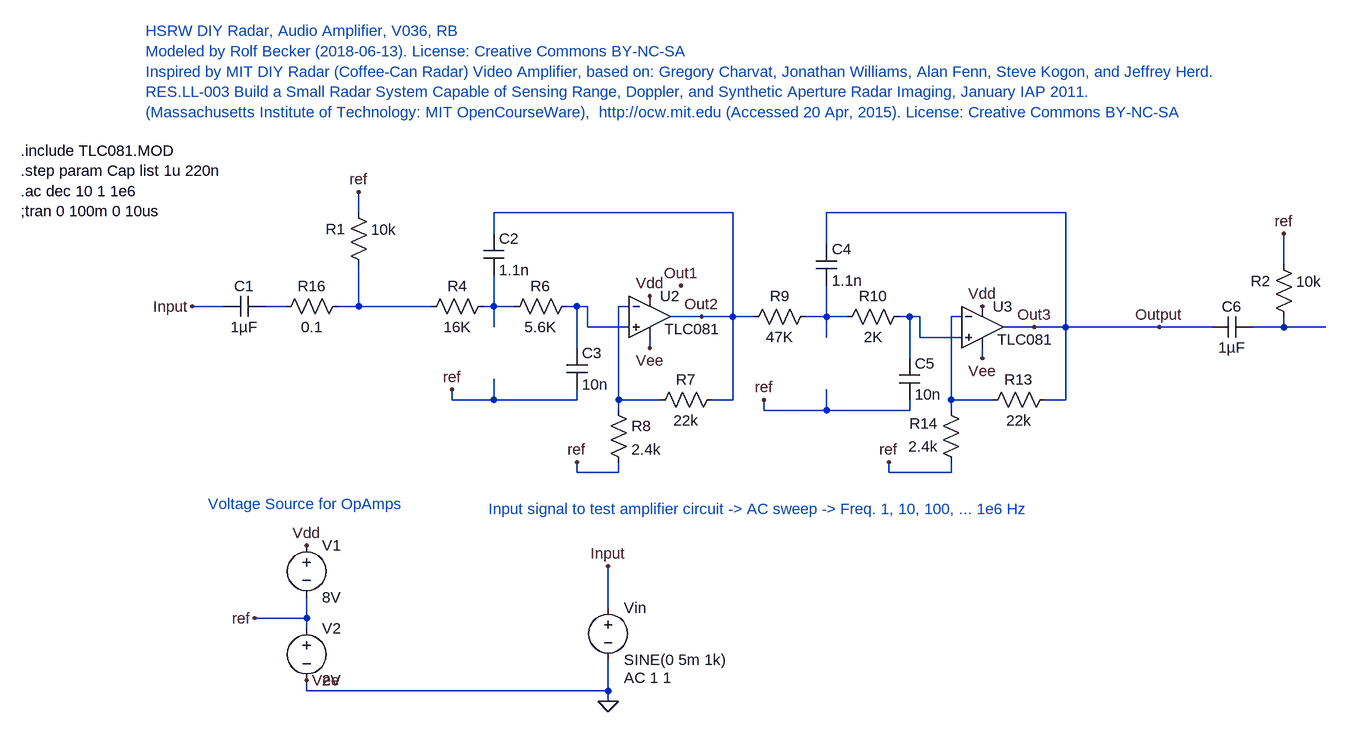
[diagram p0: schematic MIT_DIY_Radar_Audio_Amp_TLC081_V036.asc]
MIT_DIY_Radar_Audio_Amp_TLC081_V036.asc, the LTspice schematic file:
Version 4
SHEET 1 880 812
WIRE -992 0 -992 -32
WIRE -416 0 -784 0
WIRE 96 0 -272 0
WIRE -784 32 -784 0
WIRE -272 48 -272 0
WIRE 432 80 432 32
WIRE -1200 144 -1248 144
WIRE -1104 144 -1136 144
WIRE -992 144 -992 80
WIRE -992 144 -1024 144
WIRE -880 144 -992 144
WIRE -784 144 -784 96
WIRE -784 144 -800 144
WIRE -752 144 -784 144
WIRE -656 144 -672 144
WIRE -640 144 -656 144
WIRE -576 144 -592 144
WIRE -464 160 -512 160
WIRE -416 160 -416 0
WIRE -416 160 -464 160
WIRE -384 160 -416 160
WIRE -272 160 -272 112
WIRE -272 160 -304 160
WIRE -240 160 -272 160
WIRE -144 160 -160 160
WIRE -128 160 -144 160
WIRE -64 160 -80 160
WIRE -784 176 -784 144
WIRE -640 176 -640 144
WIRE -576 176 -640 176
WIRE 48 176 0 176
WIRE 96 176 96 0
WIRE 96 176 48 176
WIRE 240 176 96 176
WIRE 320 176 240 176
WIRE 432 176 432 160
WIRE 432 176 384 176
WIRE 496 176 432 176
WIRE -272 192 -272 160
WIRE -128 192 -128 160
WIRE -64 192 -128 192
WIRE -656 208 -656 144
WIRE -544 208 -544 192
WIRE -144 224 -144 160
WIRE -32 224 -32 208
WIRE -848 288 -848 272
WIRE -784 288 -784 256
WIRE -784 288 -848 288
WIRE -656 288 -656 272
WIRE -656 288 -784 288
WIRE -592 288 -592 144
WIRE -528 288 -592 288
WIRE -416 288 -416 160
WIRE -416 288 -448 288
WIRE -80 288 -80 160
WIRE -16 288 -80 288
WIRE 96 288 96 176
WIRE 96 288 64 288
WIRE -592 304 -592 288
WIRE -368 304 -368 288
WIRE -272 304 -272 272
WIRE -272 304 -368 304
WIRE -144 304 -144 288
WIRE -144 304 -272 304
WIRE -80 304 -80 288
WIRE -656 400 -656 384
WIRE -592 400 -592 384
WIRE -592 400 -656 400
WIRE -176 400 -176 384
WIRE -80 400 -80 384
WIRE -80 400 -176 400
WIRE -608 608 -608 544
WIRE -1072 624 -1072 592
WIRE -1072 624 -1152 624
WIRE -1072 640 -1072 624
WIRE -1072 736 -1072 720
WIRE -608 736 -608 688
WIRE -608 736 -1072 736
WIRE -608 752 -608 736
FLAG -1072 512 Vdd
FLAG -1072 720 Vee
FLAG -608 752 0
FLAG -608 544 Input
FLAG -1248 144 Input
FLAG 240 176 Output
FLAG -992 -32 ref
FLAG -848 272 ref
FLAG -656 384 ref
FLAG -368 288 ref
FLAG -176 384 ref
FLAG -544 128 Vdd
FLAG -32 144 Vdd
FLAG -544 208 Vee
FLAG -32 224 Vee
FLAG -496 112 Out1
FLAG -464 160 Out2
FLAG 48 176 Out3
FLAG -1152 624 ref
FLAG 432 32 ref
SYMBOL voltage -1072 496 R0
WINDOW 123 0 0 Left 2
WINDOW 39 0 0 Left 2
SYMATTR InstName V1
SYMATTR Value 8V
SYMBOL voltage -1072 624 R0
WINDOW 123 0 0 Left 2
WINDOW 39 0 0 Left 2
SYMATTR InstName V2
SYMATTR Value 2V
SYMBOL voltage -608 592 R0
WINDOW 123 24 124 Left 2
WINDOW 39 0 0 Left 2
SYMATTR Value2 AC 1 1
SYMATTR InstName Vin
SYMATTR Value SINE(0 5m 1k)
SYMBOL cap -1136 128 R90
WINDOW 0 0 32 VBottom 2
WINDOW 3 32 32 VTop 2
SYMATTR InstName C1
SYMATTR Value 1µF
SYMBOL res -1008 -16 R0
WINDOW 0 -35 41 Left 2
WINDOW 3 35 42 Left 2
SYMATTR InstName R1
SYMATTR Value 10k
SYMBOL res -784 128 R90
WINDOW 0 0 56 VBottom 2
WINDOW 3 32 56 VTop 2
SYMATTR InstName R4
SYMATTR Value 16K
SYMBOL res -656 128 R90
WINDOW 0 0 56 VBottom 2
WINDOW 3 32 56 VTop 2
SYMATTR InstName R6
SYMATTR Value 5.6K
SYMBOL cap -800 32 R0
SYMATTR InstName C2
SYMATTR Value 1.1n
SYMBOL cap -672 208 R0
SYMATTR InstName C3
SYMATTR Value 10n
SYMBOL Opamps\\opamp2 -544 96 R0
WINDOW 3 23 83 Left 2
SYMATTR Value TLC081
SYMATTR InstName U2
SYMBOL res -432 272 R90
WINDOW 0 0 56 VBottom 2
WINDOW 3 32 56 VTop 2
SYMATTR InstName R7
SYMATTR Value 22k
SYMBOL res -608 288 R0
SYMATTR InstName R8
SYMATTR Value 2.4k
SYMBOL res -288 144 R90
WINDOW 0 0 56 VBottom 2
WINDOW 3 32 56 VTop 2
SYMATTR InstName R9
SYMATTR Value 47K
SYMBOL res -144 144 R90
WINDOW 0 0 56 VBottom 2
WINDOW 3 32 56 VTop 2
SYMATTR InstName R10
SYMATTR Value 2K
SYMBOL cap -288 48 R0
SYMATTR InstName C4
SYMATTR Value 1.1n
SYMBOL cap -160 224 R0
SYMATTR InstName C5
SYMATTR Value 10n
SYMBOL Opamps\\opamp2 -32 112 R0
WINDOW 3 23 83 Left 2
SYMATTR Value TLC081
SYMATTR InstName U3
SYMBOL res 80 272 R90
WINDOW 0 0 56 VBottom 2
WINDOW 3 32 56 VTop 2
SYMATTR InstName R13
SYMATTR Value 22k
SYMBOL res -64 400 R180
WINDOW 0 36 76 Left 2
WINDOW 3 36 40 Left 2
SYMATTR InstName R14
SYMATTR Value 2.4k
SYMBOL res -1008 128 R90
WINDOW 0 0 56 VBottom 2
WINDOW 3 32 56 VTop 2
SYMATTR InstName R16
SYMATTR Value 0.1
SYMBOL cap 384 160 R90
WINDOW 0 0 32 VBottom 2
WINDOW 3 32 32 VTop 2
SYMATTR InstName C6
SYMATTR Value 1µF
SYMBOL res 416 64 R0
WINDOW 0 -35 41 Left 2
WINDOW 3 35 42 Left 2
SYMATTR InstName R2
SYMATTR Value 10k
TEXT -1512 -96 Left 2 !.include TLC081.MOD\n.step param Cap list 1u 220n\n.ac dec 10 1 1e6\n;tran 0 100m 0 10us
TEXT -1224 448 Left 2 ;Voltage Source for OpAmps
TEXT -792 456 Left 2 ;Input signal to test amplifier circuit -> AC sweep -> Freq. 1, 10, 100, ... 1e6 Hz
TEXT -1320 -280 Left 2 ;HSRW DIY Radar, Audio Amplifier, V036, RB\nModeled by Rolf Becker (2018-06-13). License: Creative Commons BY-NC-SA\nInspired by MIT DIY Radar (Coffee-Can Radar) Video Amplifier, based on: Gregory Charvat, Jonathan Williams, Alan Fenn, Steve Kogon, and Jeffrey Herd. \nRES.LL-003 Build a Small Radar System Capable of Sensing Range, Doppler, and Synthetic Aperture Radar Imaging, January IAP 2011. \n(Massachusetts Institute of Technology: MIT OpenCourseWare),  http://ocw.mit.edu (Accessed 20 Apr, 2015). License: Creative Commons BY-NC-SA

The netlist it stands for:
* MIT_DIY_Radar_Audio_Amp_TLC081_V036.asc
V1 Vdd ref 8V
V2 ref 0 2V
Vin Input 0 SINE(0 5m 1k) AC 1 1
C1 N001 Input 1µF
R1 ref N002 10k
R4 N003 N002 16K
R6 N004 N003 5.6K
C2 Out2 N003 1.1n
C3 N004 ref 10n
XU2 N004 N005 Vdd 0 Out2 TLC081  ; pins In+ In- V+ V- OUT
R7 Out2 N005 22k
R8 N005 ref 2.4k
R9 N006 Out2 47K
R10 N007 N006 2K
C4 Out3 N006 1.1n
C5 N007 ref 10n
XU3 N007 N008 Vdd 0 Out3 TLC081  ; pins In+ In- V+ V- OUT
R13 Out3 N008 22k
R14 ref N008 2.4k
R16 N002 N001 0.1
C6 N009 Out3 1µF
R2 ref N009 10k
.include TLC081.MOD
.step param Cap list 1u 220n
.ac dec 10 1 1e6
;tran 0 100m 0 10us
* Voltage Source for OpAmps
* Input signal to test amplifier circuit -> AC sweep -> Freq. 1, 10, 100, ... 1e6 Hz
* HSRW DIY Radar, Audio Amplifier, V036, RB
* Modeled by Rolf Becker (2018-06-13). License: Creative Commons BY-NC-SA
* Inspired by MIT DIY Radar (Coffee-Can Radar) Video Amplifier, based on: Gregory Charvat, Jonathan Williams, Alan Fenn, Steve Kogon, and Jeffrey Herd.
* RES.LL-003 Build a Small Radar System Capable of Sensing Range, Doppler, and Synthetic Aperture Radar Imaging, January IAP 2011.
* (Massachusetts Institute of Technology: MIT OpenCourseWare),  http://ocw.mit.edu (Accessed 20 Apr, 2015). License: Creative Commons BY-NC-SA
.backanno
.end